# Altium schematic sheet DoPro Schematic.SchDoc
size 381 x 246 mm; SheetNumber: 1; SheetTotal: 1
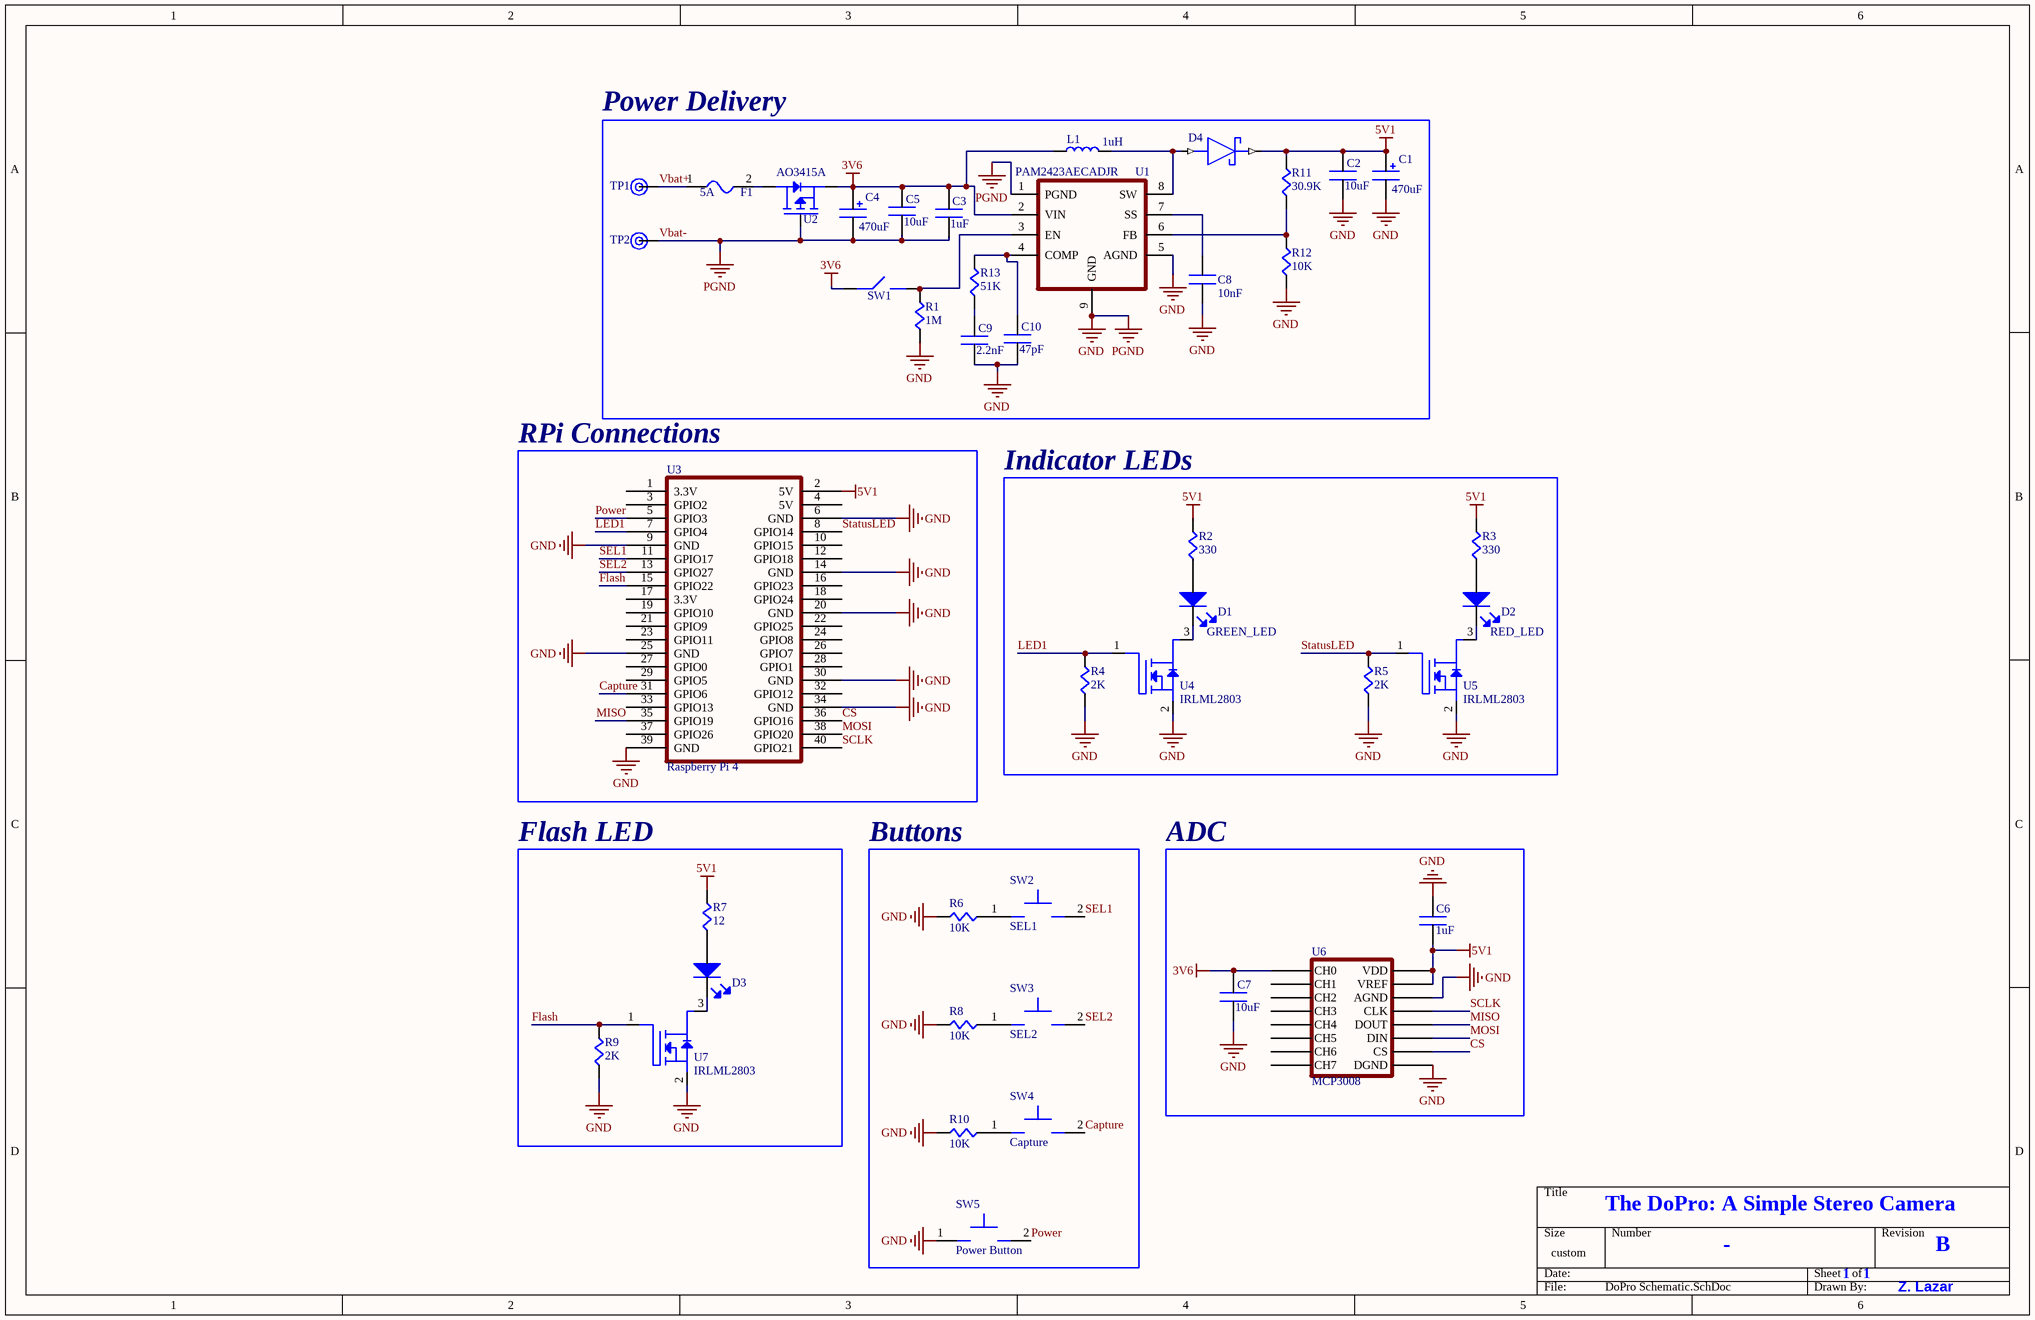
[diagram p0: DoPro Schematic.SchDoc]

## Parts
C1  470uF  [SMD_7343]
C2  10uF  [SMD_0805]
C3  1uF  [SMD_0805]
C4  470uF  [SMD_7343]
C5  10uF  [SMD_0805]
C6  1uF  [SMD_0805]
C7  10uF  [SMD_0805]
C8  10nF  [SMD_0805]
C9  2.2nF  [SMD_0805]
C10  47pF  [SMD_0805]
D1  GREEN_LED  [Test_Point_2_62D]
D2  RED_LED  [Test_Point_2_62D]
D3  MP-1616-1100-50-80  [Test_Point_2_62D]  (value not drawn)
D4  Schottky_Diode  [SMD_SMC_DO-214AB]  (value not drawn)
F1  Rating: 5A  [Littelfuse_154_OMNI-BLOK]  (hidden comment: 01550900M)
L1  1uH  [Vishay_IHLP-3232DZ-11]
R1  1M  [SMD_0805]
R2  330  [SMD_0805]
R3  330  [SMD_0805]
R4  2K  [SMD_0805]
R5  2K  [SMD_0805]
R6  10K  [SMD_0805]
R7  12  [SMD_0805]
R8  10K  [SMD_0805]
R9  2K  [SMD_0805]
R10  10K  [SMD_0805]
R11  30.9K  [SMD_0805]
R12  10K  [SMD_0805]
R13  51K  [SMD_0805]
SW1  Switch  [Test_Point_2_62D]  (value not drawn)
SW2  SEL1  [Test_Point_2_62D]
SW3  SEL2  [Test_Point_2_62D]
SW4  Capture  [Test_Point_2_62D]
SW5  Power Button  [Test_Point_2_62D]
TP1  Vbat+  [Test_Point_100D]  (value not drawn)
TP2  Vbat-  [Test_Point_100D]  (value not drawn)
U1  PAM2423AECADJR  [SMD_SO-8EP]
U2  AO3415A  [SMD_SOT-23]
U3  Raspberry Pi 4  [RPI_Connections]
U4  IRLML2803  [SMD_SOT-23]
U5  IRLML2803  [SMD_SOT-23]
U6  MCP3008  [SMD_16-SOIC]
U7  IRLML2803  [SMD_SOT-23]

## Blocks framed on the sheet
Power Delivery: C1-C5 C8-C10 D4 F1 L1 R1 R11-R13 SW1 TP1 TP2 U1 U2
RPi Connections: U3
Indicator LEDs: D1 D2 R2-R5 U4 U5
Flash LED: D3 R7 R9 U7
Buttons: R6 R8 R10 SW2-SW5
ADC: C6 C7 U6

## Nets
3V6: C3.1 C4.1 C5.1 C7.1 L1.1 SW1.1 U1.2(VIN) U2.2(S) U6.1(CH0)
5V1: C1.1 C2.1 C6.2 D4.1(K) R2.1 R3.1 R7.1 R11.1 U3.2(5V) U6.15(VREF) U6.16(VDD)
Vbat-: C1.2 C2.2 C3.2 C4.2 C5.2 C6.1 C7.2 C8.2 C9.2 C10.2 R1.2 R4.2 R5.2 R6.1 R8.1 R9.2 R10.1 R12.2 SW5.1 TP2.1 U1.1(PGND) U1.5(AGND) U1.9(GND) U2.1(G) U3.6(GND) U3.9(GND) U3.14(GND) U3.20(GND) U3.25(GND) U3.30(GND) U3.34(GND) U3.39(GND) U4.2(S) U5.2(S) U6.9(DGND) U6.14(AGND) U7.2(S)  [also labelled GND, PGND]
Capture: SW4.2 U3.31(GPIO6)
CS: U3.36(GPIO16) U6.10(CS)
Flash: R9.1 U3.15(GPIO22) U7.1(G)
LED1: R4.1 U3.7(GPIO4) U4.1(G)
MISO: U3.35(GPIO19) U6.12(DOUT)
MOSI: U3.38(GPIO20) U6.11(DIN)
Power: SW5.2 U3.5(GPIO3)
SCLK: U3.40(GPIO21) U6.13(CLK)
SEL1: SW2.2 U3.11(GPIO17)
SEL2: SW3.2 U3.13(GPIO27)
StatusLED: R5.1 U3.8(GPIO14) U5.1(G)
Vbat+: F1.1 TP1.1
NetC8_1: C8.1 U1.7(SS)
NetC9_1: C9.1 R13.2
NetC10_1: C10.1 R13.1 U1.4(COMP)
NetD1_ANOD: D1.ANOD(Anode) R2.2
NetD1_CATH: D1.CATH(Cathode) U4.3(D)
NetD2_ANOD: D2.ANOD(Anode) R3.2
NetD2_CATH: D2.CATH(Cathode) U5.3(D)
NetD3_ANOD: D3.ANOD(Anode) R7.2
NetD3_CATH: D3.CATH(Cathode) U7.3(D)
NetD4_2: D4.2(A) L1.2 U1.8(SW)
NetF1_2: F1.2 U2.3(D)
NetR1_1: R1.1 SW1.2 U1.3(EN)
NetR6_2: R6.2 SW2.1
NetR8_2: R8.2 SW3.1
NetR10_2: R10.2 SW4.1
NetR11_2: R11.2 R12.1 U1.6(FB)

Not connected (* = marked no-connect by the designer): U3 1(3.3V) 3(GPIO2) 4(5V) 10(GPIO15) 12(GPIO18) 16(GPIO23) 17(3.3V) 18(GPIO24) 19(GPIO10) 21(GPIO9) 22(GPIO25) 23(GPIO11) 24(GPIO8) 26(GPIO7) 27(GPIO0) 28(GPIO1) 29(GPIO5) 32(GPIO12) 33(GPIO13) 37(GPIO26); U6 2(CH1) 3(CH2) 4(CH3) 5(CH4) 6(CH5) 7(CH6) 8(CH7)

## Notes on the sheet
- The DoPro: A Simple Stereo Camera
- -
- B
- 1
- Z. Lazar

## Library data of the parts
C1 C4 = Capacitor_Polarized
C2 C3 C5-C10 = Capacitor
D1-D3 = LED
F1 = Fuse_ZAYA: Holder: 01550900M        Fuse: 0454005.MR
L1 = Inductor: IHLP3232DZER1R0M11
R1-R6 R8-R13 = RESISTOR_4_DOUG
R7 = RESISTOR_4_DOUG: P/N: ERJ-P06J120V
SW2-SW5 = Button
TP1 TP2 = Test_Point
U2 = AO3415A_ZAYA
U4 U5 U7 = IRLML2803_ZAYA
U6 = MCP3008_ZAYA